# Altium schematic sheet dc_to_dc.SchDoc
size A; SheetNumber: 6; SheetTotal: 6
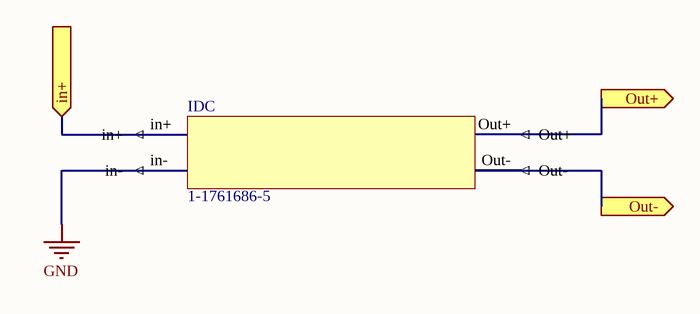
[diagram p0: dc_to_dc.SchDoc]

## Parts
IDC  1-1761686-5

## Ports
in+ (in, see finetunebox[1D], ZK-SJ20[1B]), Out+ (out, see finetunebox[2D]), Out- (out, see finetunebox[2D])

## Nets
GND: IDC.in-
in+: IDC.in+ ; port in+
Out+: IDC.Out+ ; port Out+
Out-: IDC.Out- ; port Out-

## Library data of the parts
IDC = dc_dc